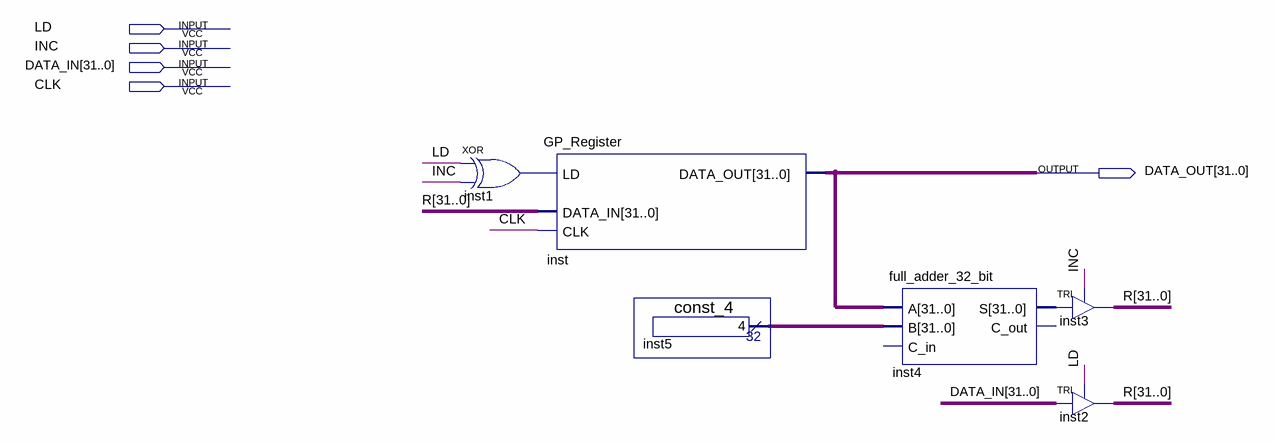
[diagram p0: schematic sheet]
// Quartus schematic PC_Register.bdf as structural Verilog: 6 symbols, 5 pins
module PC_Register (
  input  LD,
  input  INC,
  input  [31:0] DATA_IN,
  input  CLK,
  output [31:0] DATA_OUT
);

  wire inst1_out;
  wire [31:0] inst4_s, inst5_result, R;

  xor inst1 (inst1_out, LD, INC);
  GP_Register inst (.LD(inst1_out), .DATA_IN(R), .CLK(CLK), .DATA_OUT(DATA_OUT));
  const_4 inst5 (.result(inst5_result));
  full_adder_32_bit inst4 (.A(DATA_OUT), .B(inst5_result), .S(inst4_s));  // open: C_in, C_out
  TRI inst3[31:0] (.IN(inst4_s), .OE(INC), .OUT(R));
  TRI inst2[31:0] (.IN(DATA_IN), .OE(LD), .OUT(R));
endmodule
